# Altium schematic sheet IWatch_DISP.SchDoc
size A2; DocStatus: Draft
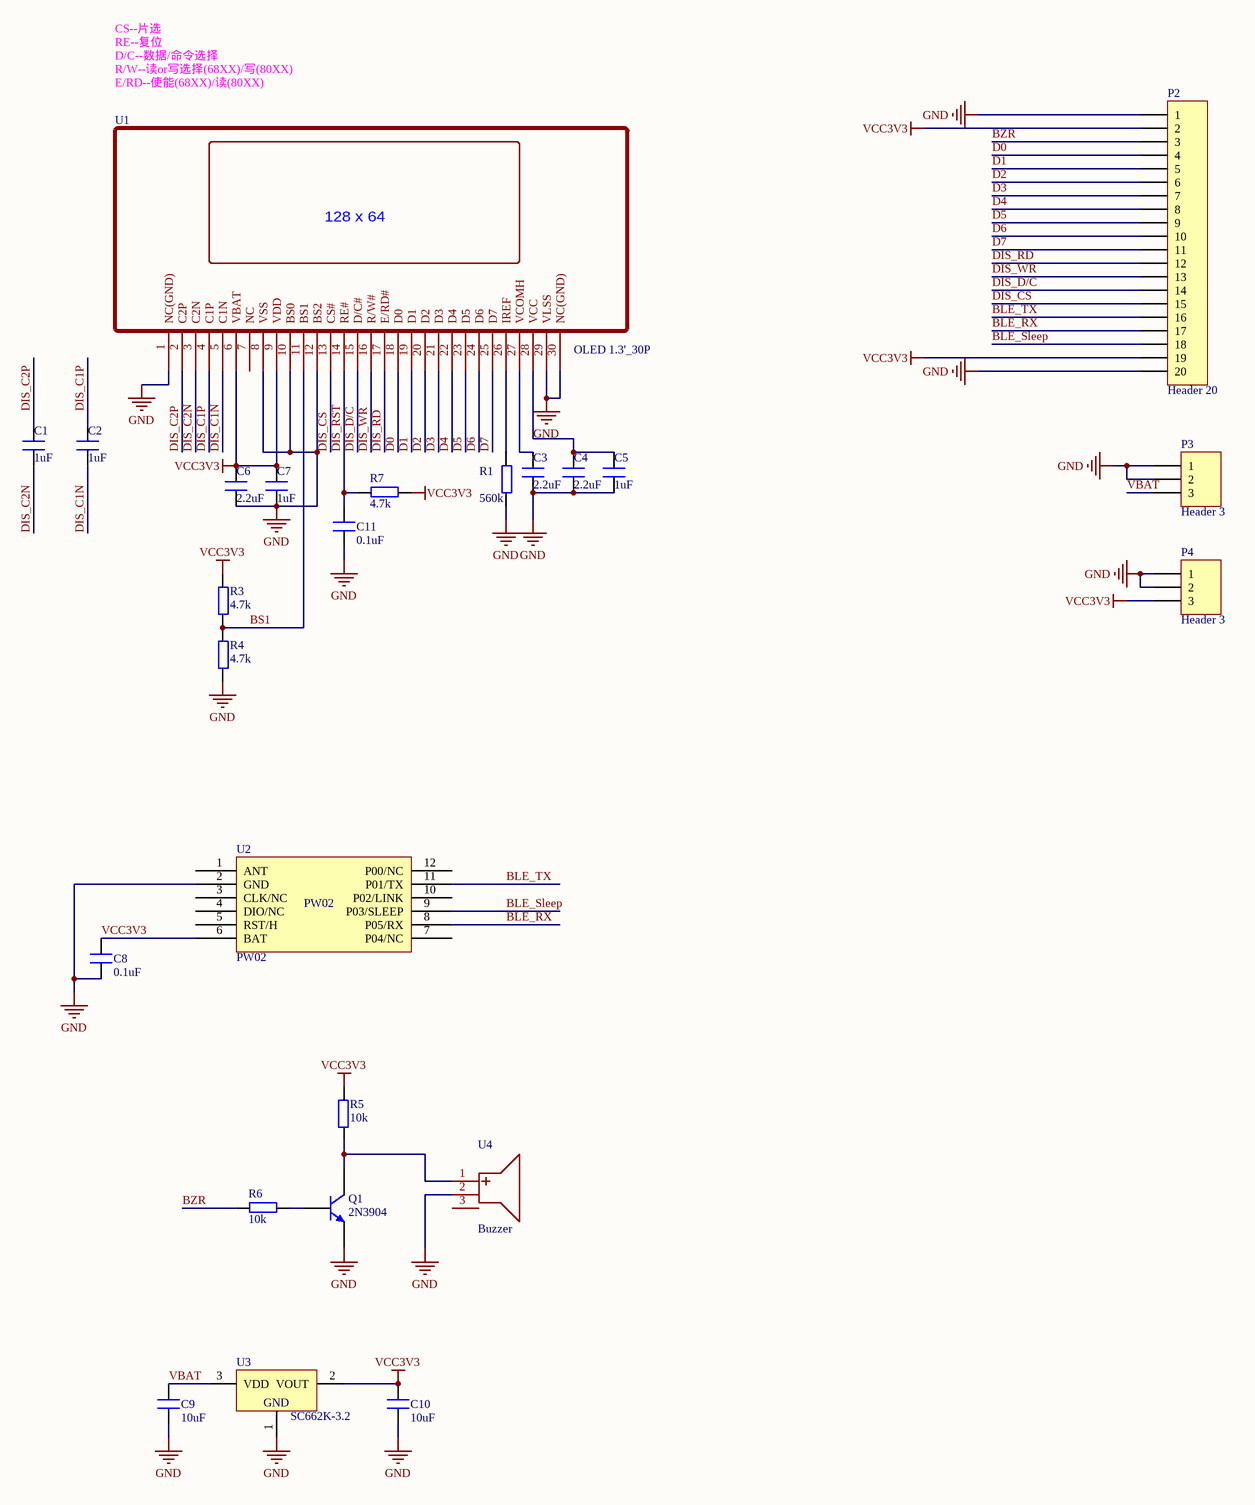
[diagram p0: IWatch_DISP.SchDoc]

## Parts
C1  1uF  [C0603]
C2  1uF  [C0603]
C3  2.2uF  [C0603]
C4  2.2uF  [C0603]
C5  1uF  [C0603]
C6  2.2uF  [C0603]
C7  1uF  [C0603]
C8  0.1uF  [C0603]
C9  10uF  [C0603]
C10  10uF  [C0603]
C11  0.1uF  [C0603]
P2  Header 20  [HDR_1X20P_1.27MM]
P3  Header 3  [HDR_1X3P_1.27MM]
P4  Header 3  [HDR_1X3P_1.27MM]
Q1  2N3904  [SOT23-3]
R1  560k  [R0603]
R3  4.7k  [R0603]
R4  4.7k  [R0603]
R5  10k  [R0603]
R6  10k  [R0603]
R7  4.7k  [R0603]
U1  OLED 1.3'_30P  [OLED 1.3'_30P]
U2  PW02  [PW02]
U3  SC662K-3.2  [SOT23-3]
U4  Buzzer  [Buzzer_5.5x2.5mm]

## Nets
GND: C3.1 C4.1 C5.1 C6.1 C7.1 C8.1 C9.1 C10.1 C11.1 P2.1 P2.20 P3.1 P3.2 P4.1 P4.2 Q1.1(E) R1.1 R4.1 U1.1(NC(GND)) U1.8(VSS) U1.10(BS0) U1.12(BS2) U1.29(VLSS) U1.30(NC(GND)) U2.2(GND) U3.1(GND) U4.2(-)
VCC3V3: C6.2 C7.2 C8.2 C10.2 P2.2 P2.19 P4.3 R3.2 R5.1 R7.1 U1.6(VBAT) U1.9(VDD) U2.6(BAT) U3.2(VOUT)
BLE_RX: P2.17 U2.8(P05/RX)
BLE_Sleep: P2.18 U2.9(P03/SLEEP)
BLE_TX: P2.16 U2.11(P01/TX)
BS1: R3.1 R4.2 U1.11(BS1)
BZR: P2.3 R6.2
D0: P2.4 U1.18(D0)
D1: P2.5 U1.19(D1)
D2: P2.6 U1.20(D2)
D3: P2.7 U1.21(D3)
D4: P2.8 U1.22(D4)
D5: P2.9 U1.23(D5)
D6: P2.10 U1.24(D6)
D7: P2.11 U1.25(D7)
DIS_C1N: C2.1 U1.5(C1N)
DIS_C1P: C2.2 U1.4(C1P)
DIS_C2N: C1.1 U1.3(C2N)
DIS_C2P: C1.2 U1.2(C2P)
DIS_CS: P2.15 U1.13(CS#)
DIS_D/C: P2.14 U1.15(D/C#)
DIS_RD: P2.12 U1.17(E/RD#)
DIS_RST: C11.2 R7.2 U1.14(RE#)
DIS_WR: P2.13 U1.16(R/W#)
VBAT: C9.2 P3.3 U3.3(VDD)
NetC3_2: C3.2 U1.27(VCOMH)
NetC4_2: C4.2 C5.2 U1.28(VCC)
NetQ1_2: Q1.2(B) R6.1
NetQ1_3: Q1.3(C) R5.2 U4.1(+)
NetR1_2: R1.2 U1.26(IREF)

Not connected (* = marked no-connect by the designer): U1 7(NC); U2 1(ANT) 3(CLK/NC) 4(DIO/NC) 5(RST/H) 7(P04/NC) 10(P02/LINK) 12(P00/NC); U4 3

## Notes on the sheet
- CS--片选
  RE--复位
  D/C--数据/命令选择
  R/W--读or写选择(68XX)/写(80XX)
  E/RD--使能(68XX)/读(80XX)
- Title
- Size:
- Date:
- File:
- A2
- Number:
- Time:
- Revision:
- Sheet
- of
- (in symbol OLED 1.3'_30P) 128 x 64

## Library data of the parts
C1-C11 = C
P2 = Header 20: Header, 20-Pin; LatestRevisionDate: 17-Jul-2002; LatestRevisionNote: Re-released for DXP Platform.; Publisher: Altium Limited
P3 P4 = Header 3: Header, 3-Pin; LatestRevisionDate: 17-Jul-2002; LatestRevisionNote: Re-released for DXP Platform.; Publisher: Altium Limited
Q1 = 2N3904: NPN General Purpose Amplifier; Published: 8-Jun-2000; LatestRevisionDate: 15-Jan-2003; LatestRevisionNote: PCB Footprint 'BCY-W3/D4.7' replaced; DatasheetVersion: 1997; PackageVersion: Sep-1998; PackageReference: TO-92A; Publisher: Altium Limited; PackageDescription: TO, Flat Index; 3 In-Line, Axial Leads; Body Dia. 4.5mm; Leads 0.51 x 0.48 mm (max); ComponentLink1Description: Manufacturer Link; ComponentLink1URL: http://www.fairchildsemi.com/; ComponentLink2Description: Datasheet; ComponentLink2URL: http://www.fairchildsemi.com/ds/2N%2F2N3904.pdf
R1 R3-R7 = R
U1 = OLED 1.3'_30P: 1.3寸oled显示屏12864 分辨率 驱动芯片ssd1315兼容ssd1306
U2 = PW02: PW02 蓝牙模块 蓝牙5.0 串口透传,DA14585芯片
U3 = SC662K-3.2: Low Dropout,  250mA